# EAGLE design KGM Feedback v1.0 (EAGLE 5.11)
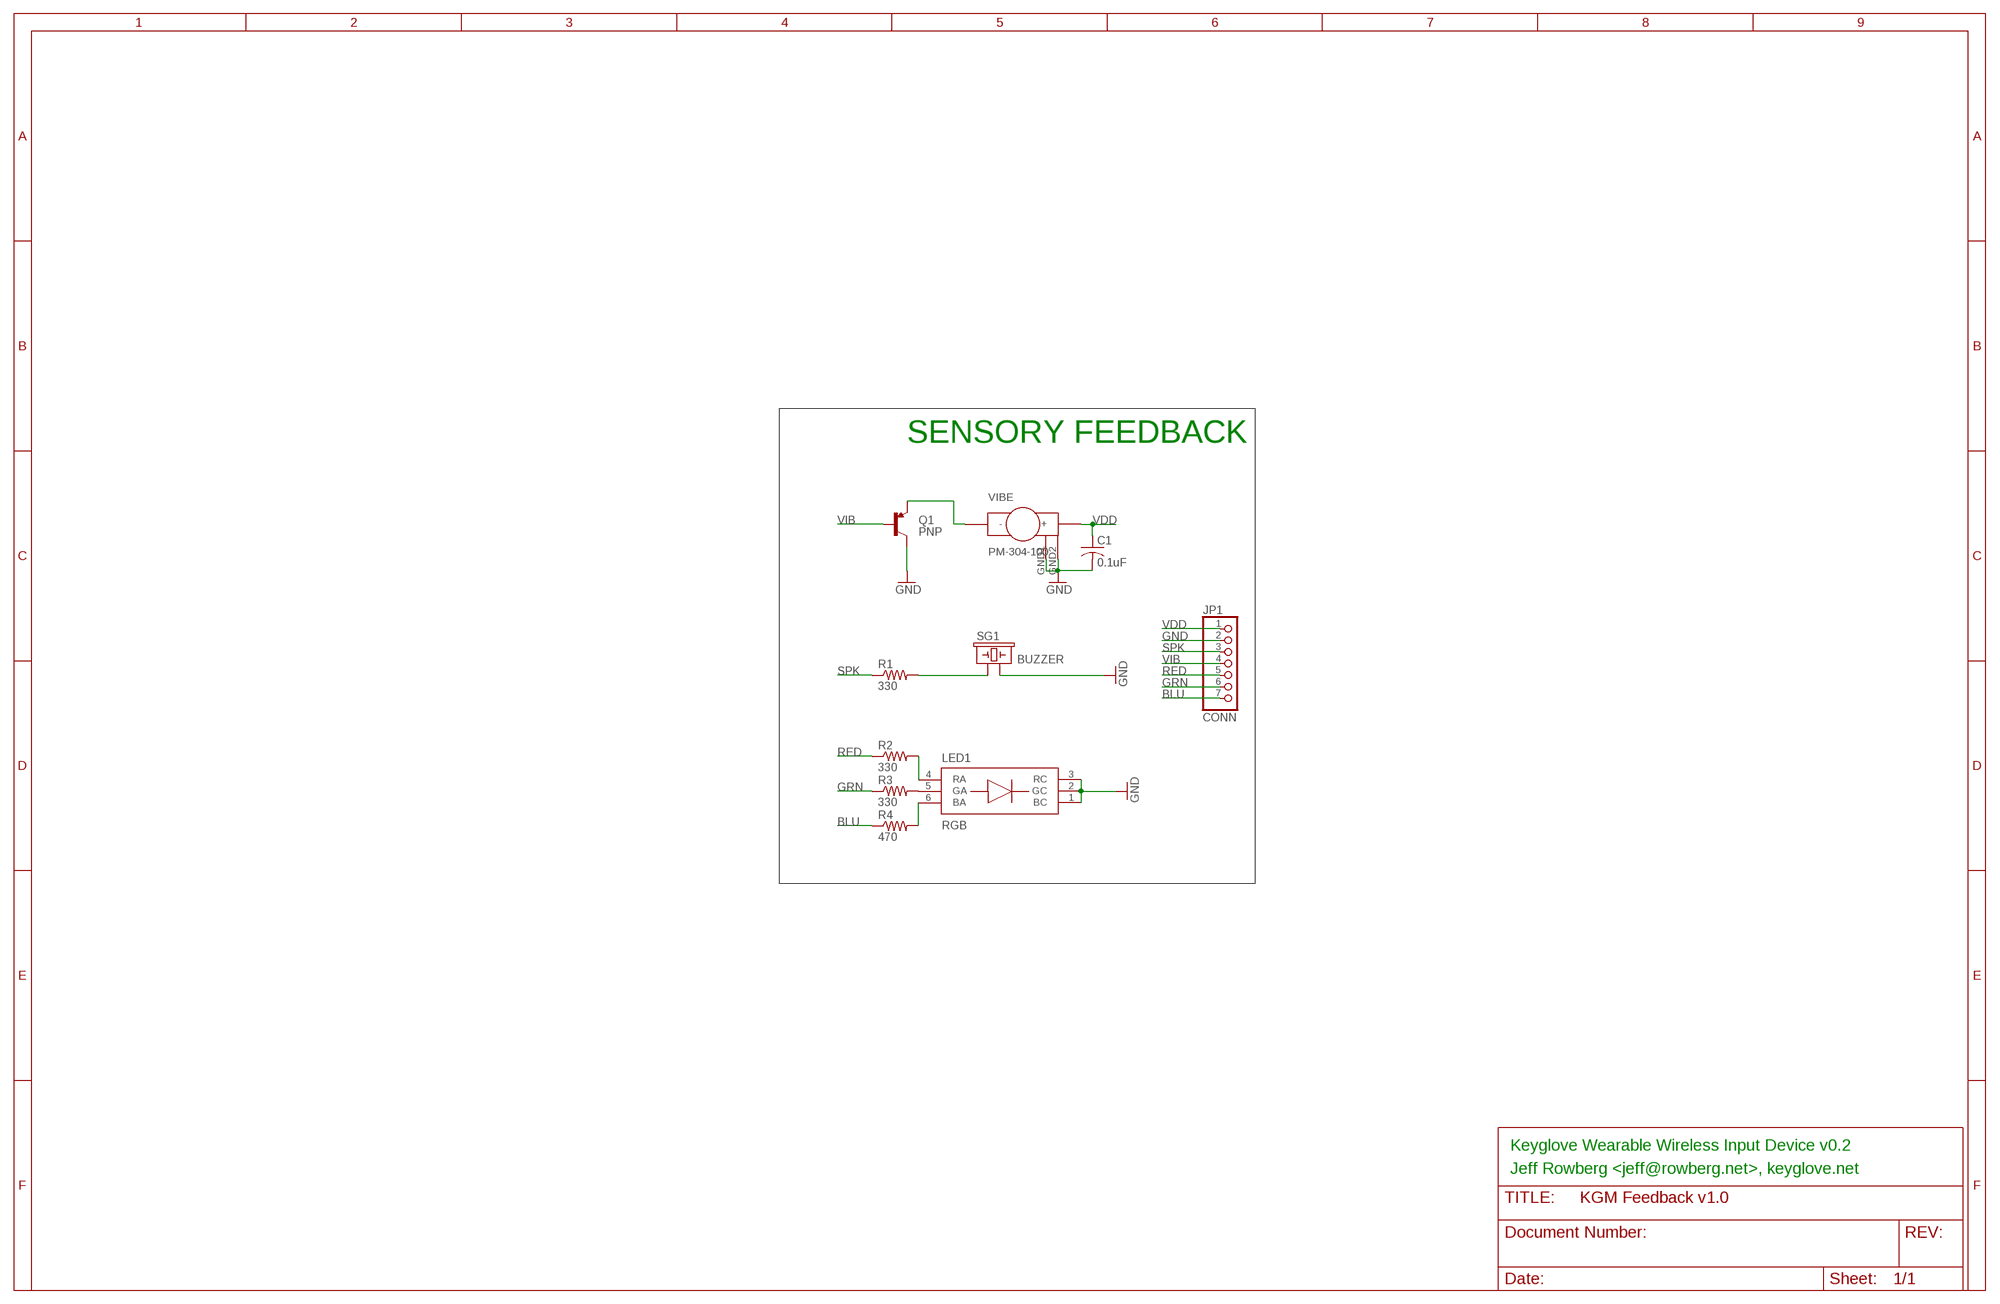
[diagram p0: schematic, sheet 1]

## Parts
C1  0.1uF  C-USC0603  [C0603]
JP1  CONN  PINHD-1X7  [1X07]
LED1  RGB  ASMT-YTB2  [PLCC-6]
Q1  PNP  TRANSISTOR_PNPSMD  [SOT23-3]
R1  330  R-US_R0603  [R0603]
R2  330  R-US_R0603  [R0603]
R3  330  R-US_R0603  [R0603]
R4  470  R-US_R0603  [R0603]
SG1  BUZZER  BUZZERSMD3  [BUZZER-CMT1102]
VIBE  PM-304-100  [PM-304-100]

## Nets
BLU: JP1.7 R4.1
GND [power]: C1.2 JP1.2 LED1.1(BC) LED1.2(GC) LED1.3(RC) Q1.3(C) SG1.2 VIBE.GND1(GND) VIBE.GND2(GND)
GRN: JP1.6 R3.1
N$1: R1.2 SG1.1
N$2: LED1.5(GA) R3.2
N$3: LED1.4(RA) R2.2
N$4: LED1.6(BA) R4.2
N$15 [power]: Q1.2(E) VIBE.-
RED: JP1.5 R2.1
SPK: JP1.3 R1.1
VDD [power]: C1.1 JP1.1 VIBE.+
VIB: JP1.4 Q1.1(B)

## Notes on the sheet
- SENSORY FEEDBACK
- Keyglove Wearable Wireless Input Device v0.2
- Jeff Rowberg <jeff@rowberg.net>, keyglove.net

## Library data of the parts
C1 = resistor:C-US: CAPACITOR, American symbol
JP1 = sf-pinhead:PINHD-1X7: PIN HEADER
LED1 = sf-keyglove:ASMT-YTB2
Q1 = SparkFun:TRANSISTOR_PNP
R1-R4 = resistor:R-US_: RESISTOR, American symbol
SG1 = SparkFun:BUZZER: Buzzer 12mm Spark Fun Electronics SKU : Comp-Buzzer
VIBE = sf-keyglove:PM-304-100

## Net classes
0 default: width 0.152 mm, drill 0.305 mm, clearance 0.152 mm
1 power: width 0.254 mm, drill 0.305 mm, clearance 0.152 mm

## Board
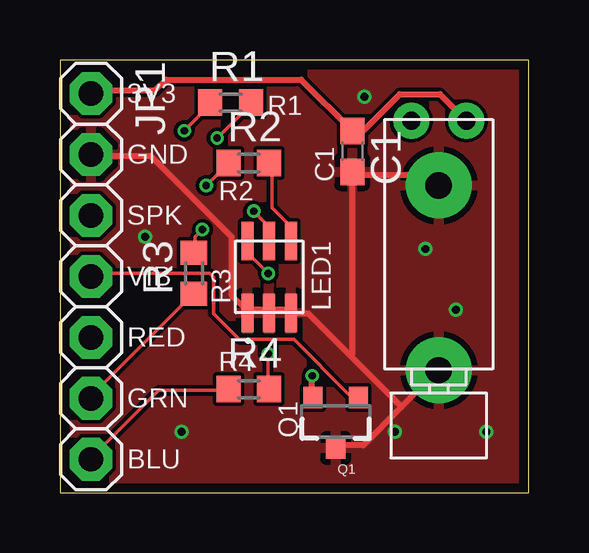
[diagram p1: board, top side]
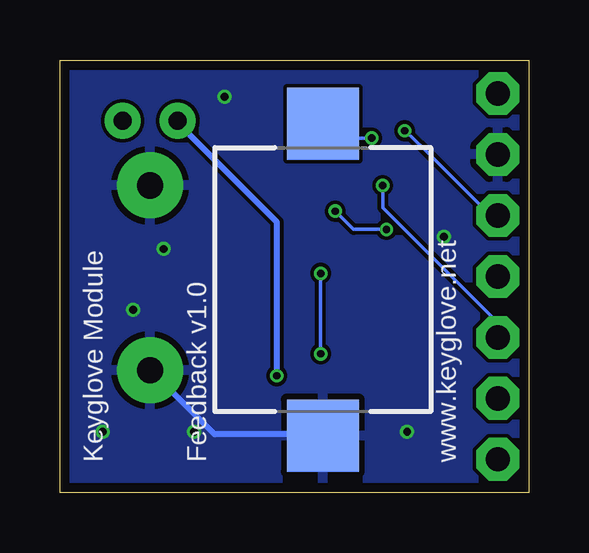
[diagram p2: board, bottom side, seen from below]

Size 19.56 x 18.03 mm. Coordinates in mm from the lower left corner, seen from the top.
Outline: 0,0 19.56,0 19.56,18.03 0,18.03 0,0
Copper layers (1*16): Top 0.0356mm / dielectric 1.5011mm / Bottom 0.0356mm
Design rules "PCBWingOrder *": minimum track width 6mil, minimum drill 12mil, track to track 6mil, track to pad 6mil, pad to pad 6mil, via to via 6mil, smd to smd 6mil, copper to edge 15mil, drill to drill 6mil, minimum pad ring 6mil, minimum via ring 5mil, stop-mask expansion 4mil, vias tented up to drill 20mil, thermal gap 10mil

### Footprints (pad centres in the part's own frame; a part is rotated, then mirrored left to right if it is on the bottom)
C0603 = smd 1.1 x 1: 1 -0.85,0; 2 0.85,0
1X07 = drill 1.016 pad 1.778 octagon: 1 -7.62,0; 2 -5.08,0; 3 -2.54,0; 4 0,0; 5 2.54,0; 6 5.08,0; 7 7.62,0
PLCC-6 = smd 1.6 x 0.5: 1 1.5,-0.9; 2 1.5,0; 3 1.5,0.9; 4 -1.5,0.9; 5 -1.5,0; 6 -1.5,-0.9
SOT23-3 = smd 0.8 x 0.9: 1 -0.95,-1; 2 0.95,-1; 3 0,1.1
R0603 = smd 1 x 1.1: 1 -0.85,0; 2 0.85,0
BUZZER-CMT1102 = smd 3 x 3: 1 -6.5,0; 2 6.5,0
PM-304-100 = drill 0.75 pad 1.5 round: + 2.7,-1.15; - 2.7,1.15 | drill 1.1 pad 2.75 round: GND1 0,0; GND2 -7.7,0

### Placement (x,y rotation side)
C1  12.19,14.22 270 top
JP1  1.3,9.02 270 top
LED1  8.73,9 270 top
Q1  11.5,2.97 180 top
R1  7.11,16.26 0 top
R2  7.87,13.74 0 top
R3  5.59,9.14 90 top
R4  7.87,4.32 0 top
SG1  8.59,8.88 270 bottom
VIBE  15.8,12.81 90 top

### Tracks (layer width: path | path; a pad name or v marks a point on that pad's centre or on a via)
BLU
  Top 0.152: R4.1 7.01,4.27 4.12,4.27 1.37,1.52 JP1.7
GND  (via drill 0.33)
  Top 0.254: 12.19,13.26 15.39,13.26 15.7,12.95 VIBE.GND1 | 14.25,3.58 15.7,5.03 VIBE.GND2 | 14.25,3.58 12.65,1.98 11.58,1.98 Q1.3 | 12.12,5.71 10.36,7.47 9.75,7.47 LED1.3 9.6,7.62 8.84,7.62 LED1.2 8.69,7.62 7.92,7.62 LED1.1 7.77,7.62 7.16,8.23 7.16,10.67 3.81,14.02 1.37,14.02 JP1.2 | 14.25,3.58 12.12,5.71 | 12.19,13.26 12.19,5.79 12.12,5.71 | 12.19,13.26 C1.2
  Bottom 0.254: SG1.2 8.69,2.44 13.11,2.44 15.7,5.03 VIBE.GND2
  other vias: 12.7,16.51 15.24,10.16 16.51,7.62 13.97,2.54 17.78,2.54 5.08,2.54 3.56,10.67
  pour Bottom: 0.25,17.78 19.3,17.78 19.3,0.25 0.25,0.25
  pour Top: 0.25,17.78 19.3,17.78 19.3,0.25 0.25,0.25
GRN
  Top 0.152: R3.1 5.49,8.23 1.22,3.96 JP1.6
N$1  (via drill 0.3)
  Top 0.152: v6.55,14.78 7.92,16.15 R1.2
  Bottom 0.152: v6.55,14.78 8.08,14.78 8.53,15.24 SG1.1
N$2  (via drill 0.3)
  Top 0.152: v5.94,10.97 5.64,10.67 5.64,10.06 R3.2 | v8.08,11.73 8.69,11.12 8.69,10.52 LED1.5
  Bottom 0.152: v5.94,10.97 7.32,10.97 v8.08,11.73
N$3
  Top 0.152: R2.2 8.84,13.72 8.84,11.89 9.6,11.12 9.6,10.52 LED1.4
N$4  (via drill 0.3)
  Top 0.152: v8.69,5.79 8.69,4.42 R4.2 | v8.69,9.14 7.92,9.91 7.92,10.36 LED1.6
  Bottom 0.152: v8.69,5.79 v8.69,9.14
N$15  (via drill 0.3)
  Top 0.254: v10.52,4.88 10.52,4.12 Q1.2
  Bottom 0.254: v10.52,4.88 10.52,11.28 14.63,15.39 VIBE.-
RED  (via drill 0.3)
  Top 0.152: v6.1,12.8 7.01,13.72 R2.1
  Bottom 0.152: v6.1,12.8 6.1,11.89 1.37,7.16 1.37,6.55 JP1.5
SPK  (via drill 0.3)
  Top 0.152: v5.18,15.09 6.25,16.15 R1.1
  Bottom 0.152: v5.18,15.09 4.37,14.33 1.63,11.58 JP1.3
VDD
  Top 0.254: 12.19,15.09 12.65,15.09 14.17,16.61 15.85,16.61 16.92,15.54 VIBE.+ | 12.19,15.09 10.06,17.22 4.42,17.22 3.96,16.76 1.37,16.76 JP1.1 | 12.19,15.09 C1.1
VIB
  Top 0.152: Q1.1 12.34,4.12 12.04,4.12 9.75,6.4 7.47,6.4 6.4,7.47 6.4,8.99 6.25,9.14 1.37,9.14 JP1.4

### Text on the board
tPlace: 3V3 | R1 | GND | C1 | R2 | SPK | VIB | R3 | RED | R4 | GRN | Q1 | BLU
bPlace: www.keyglove.net | Feedback v1.0 | Keyglove Module